# Altium schematic sheet OBC_Connectors_PC-104.SchDoc: Connectors / PC-104
size A4; SheetNumber: 3; SheetTotal: 10
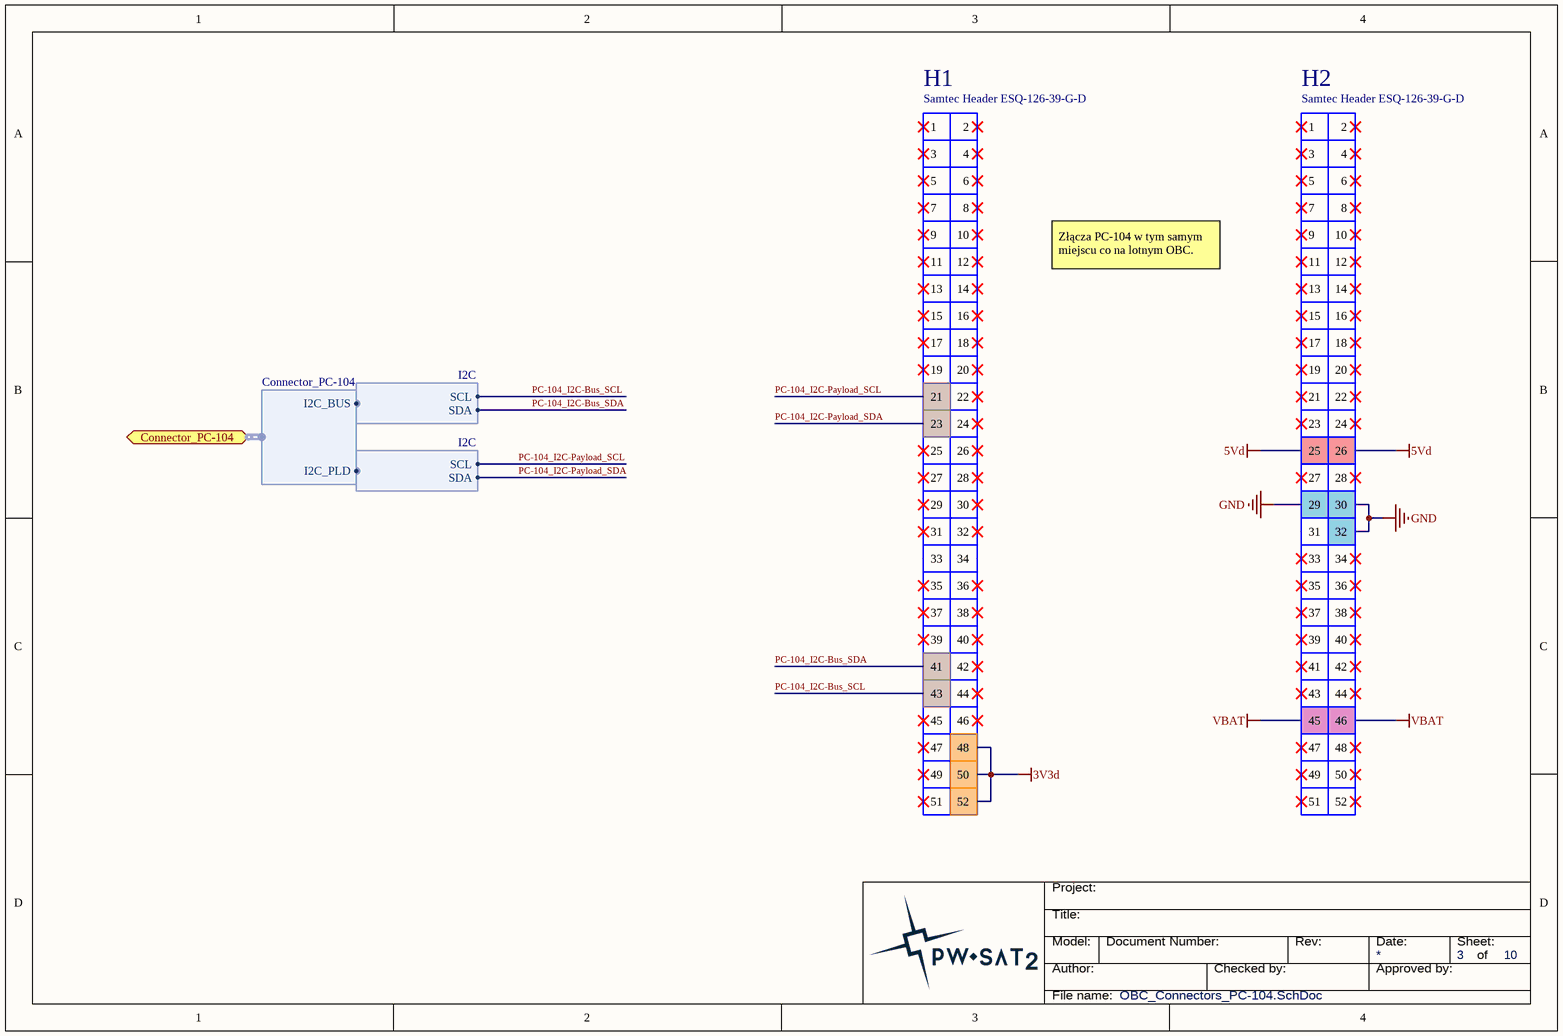
[diagram p0: OBC_Connectors_PC-104.SchDoc]

## Parts
H1  Samtec Header ESQ-126-39-G-D  [SAMTEC_ESQ-126-39-G-D]
H2  Samtec Header ESQ-126-39-G-D  [SAMTEC_ESQ-126-39-G-D]

## Ports
Connector_PC-104 (harness Connector_PC-104)

## Harnesses
I2C: SDA, SCL
Connector_PC-104: I2C_BUS, I2C_PLD

## Nets
3V3d: H1.48 H1.50 H1.52
5Vd: H2.25 H2.26
GND: H2.29 H2.30 H2.32
VBAT: H2.45 H2.46
PC-104_I2C-Bus_SCL: H1.43 ; harness I2C.SCL
PC-104_I2C-Bus_SDA: H1.41 ; harness I2C.SDA
PC-104_I2C-Payload_SCL: H1.21 ; harness I2C.SCL
PC-104_I2C-Payload_SDA: H1.23 ; harness I2C.SDA

Not connected (* = marked no-connect by the designer): H1 1* 2* 3* 4* 5* 6* 7* 8* 9* 10* 11* 12* 13* 14* 15* 16* 17* 18* 19* 20* 22* 24* 25* 26* 27* 28* 29* 30* 31* 32* 33 34 35* 36* 37* 38* 39* 40* 42* 44* 45* 46* 47* 49* 51*; H2 1* 2* 3* 4* 5* 6* 7* 8* 9* 10* 11* 12* 13* 14* 15* 16* 17* 18* 19* 20* 21* 22* 23* 24* 27* 28* 31 33* 34* 35* 36* 37* 38* 39* 40* 41* 42* 43* 44* 47* 48* 49* 50* 51* 52*

## Notes on the sheet
- Złącza PC-104 w tym samym miejscu co na lotnym OBC.
- Title:
- Project:
- Author:
- Model:
- Document Number:
- Checked by:
- Rev:
- Date:
- Approved by:
- Sheet:
- of
- File name:

## Library data of the parts
H1 H2 = Samtec_ESQ-126-xx-x-D: Samtec ESQ Series Header , 2.54mm pitch, 2x26pin. PC-104 Stack Connector.; partNo: ESQ-126-39-G-D; Supplier 1: Digi-Key; Digi-Key: SAM8772-ND; Manufacturer: Samtec; Comment_1: Samtec Header ESQ-126-39-G-D